# Altium schematic sheet usb_host_slave.SchDoc: Edison Gateway - USB
size Letter; Author: Ye-Sheng Kuo; DocumentNumber: 4; Revision: 3; SheetNumber: 4; SheetTotal: 10
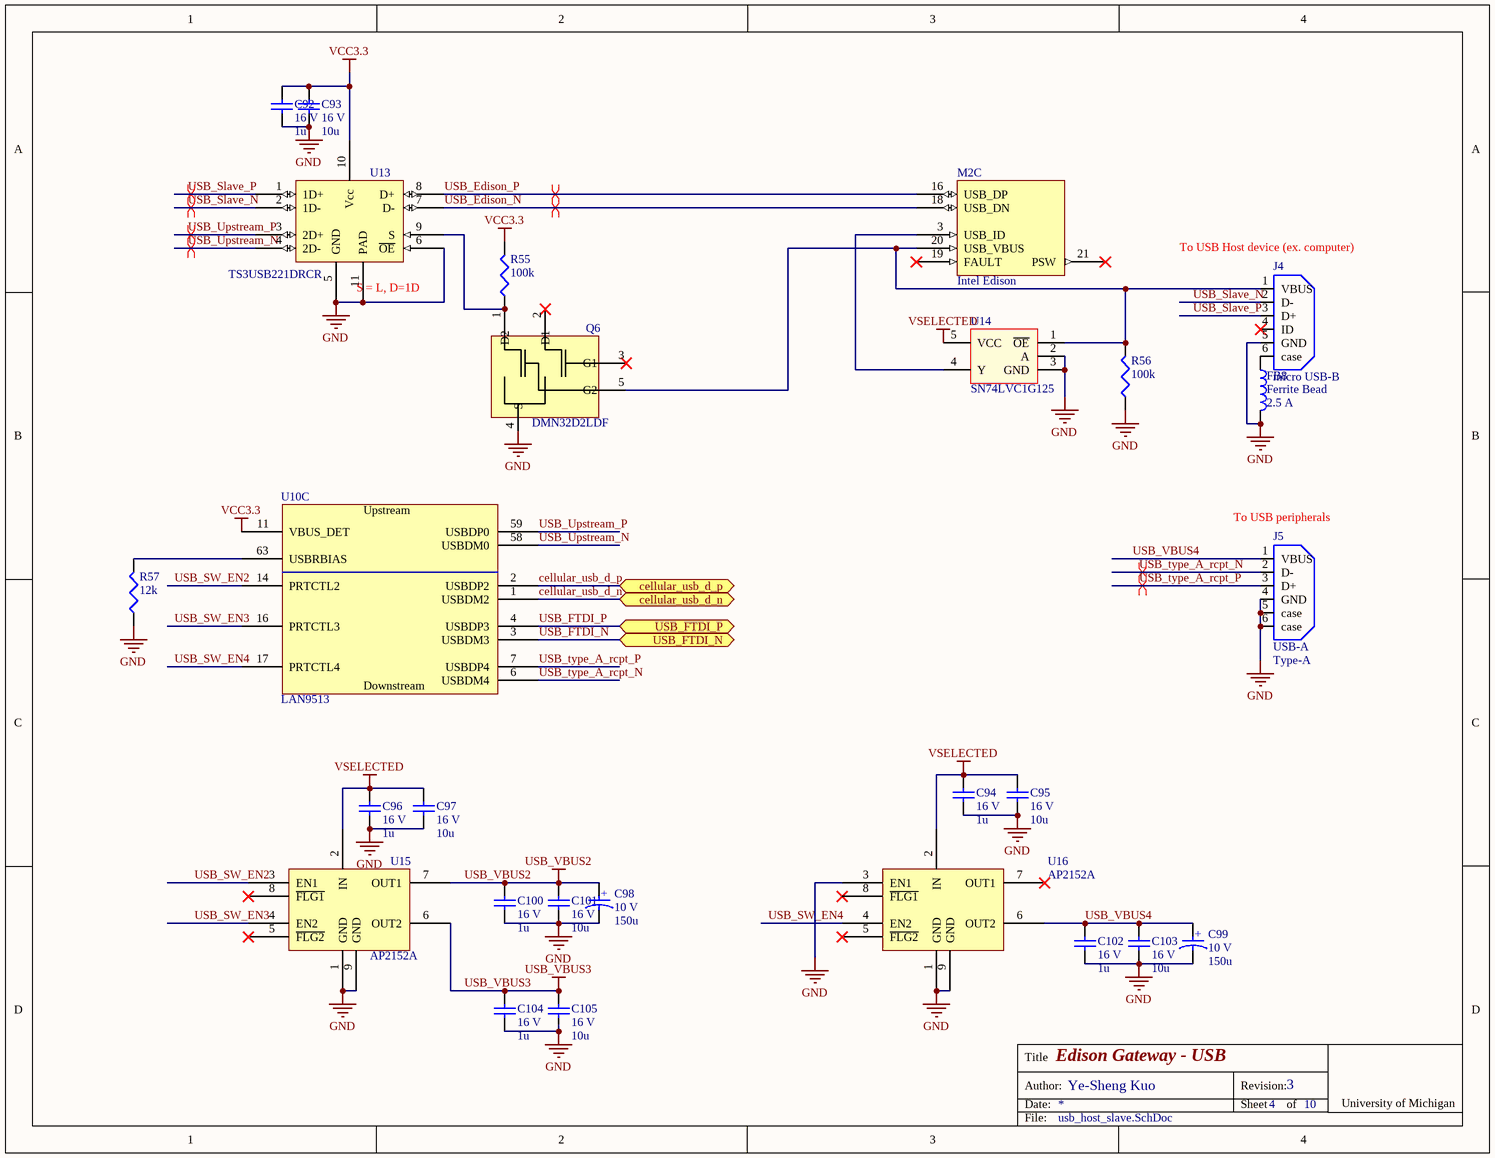
[diagram p0: usb_host_slave.SchDoc]

## Parts
C92  voltage rated: 16 V  [0402]  (hidden comment: 1u)
C93  voltage rated: 16 V  [0603]  (hidden comment: 10u)
C94  voltage rated: 16 V  [0402]  (hidden comment: 1u)
C95  voltage rated: 16 V  [0603]  (hidden comment: 10u)
C96  voltage rated: 16 V  [0402]  (hidden comment: 1u)
C97  voltage rated: 16 V  [0603]  (hidden comment: 10u)
C98  voltage rated: 10 V  [2312]  (hidden comment: 150u)
C99  voltage rated: 10 V  [2312]  (hidden comment: 150u)
C100  voltage rated: 16 V  [0402]  (hidden comment: 1u)
C101  voltage rated: 16 V  [0603]  (hidden comment: 10u)
C102  voltage rated: 16 V  [0402]  (hidden comment: 1u)
C103  voltage rated: 16 V  [0603]  (hidden comment: 10u)
C104  voltage rated: 16 V  [0402]  (hidden comment: 1u)
C105  voltage rated: 16 V  [0603]  (hidden comment: 10u)
FB8  Ferrite Bead  Current Rating (Max): 2.5 A  [0603]
J4  micro USB-B  [Micro USB-B]
J5  USB-A  Type: Type-A  [292303-2]
M2  Intel Edison  [Intel Edison mating]  (part C of 5)
Q6  DMN32D2LDF  [SOT-353-5]
R55  100k  [0402]
R56  100k  [0402]
R57  12k  [0402]
U10  LAN9513  [QFN-64]  (part C of 5)
U13  TS3USB221DRCR  [S-PVSON-N10]
U14  SN74LVC1G125  [SOT23-5]
U15  AP2152A  [U-DFN3030-8]
U16  AP2152A  [U-DFN3030-8]

## Ports
cellular_usb_d_n, cellular_usb_d_p, USB_FTDI_N, USB_FTDI_P

## Nets
GND: C92.2 C93.2 C94.2 C95.2 C96.2 C97.2 C98.2 C99.2 C100.2 C101.2 C102.2 C103.2 C104.2 C105.2 FB8.1 J4.5(GND) J5.4(GND) J5.5(case) J5.6(case) Q6.4(S) R56.2 R57.2 U13.5(GND) U13.6(~{OE}) U13.11(PAD) U14.2(A) U14.3(GND) U15.1(GND) U15.9(GND) U16.1(GND) U16.3(EN1) U16.9(GND)
USB_VBUS2: C98.1 C100.1 C101.1 U15.7(OUT1)
USB_VBUS3: C104.1 C105.1 U15.6(OUT2)
VCC3.3: C92.1 C93.1 R55.1 U10.11(VBUS_DET) U13.10(Vcc)
VSELECTED: C94.1 C95.1 C96.1 C97.1 U14.5(VCC) U15.2(IN) U16.2(IN)
cellular_usb_d_n: U10.1(USBDM2) ; port cellular_usb_d_n
cellular_usb_d_p: U10.2(USBDP2) ; port cellular_usb_d_p
USB_Edison_N: M2.18(USB_DN) U13.7(D-)
USB_Edison_P: M2.16(USB_DP) U13.8(D+)
USB_FTDI_N: U10.3(USBDM3) ; port USB_FTDI_N
USB_FTDI_P: U10.4(USBDP3) ; port USB_FTDI_P
USB_Slave_N: J4.2(D-) U13.2(1D-)
USB_Slave_P: J4.3(D+) U13.1(1D+)
USB_SW_EN2: U10.14(PRTCTL2) U15.3(EN1)
USB_SW_EN3: U10.16(PRTCTL3) U15.4(EN2)
USB_SW_EN4: U10.17(PRTCTL4) U16.4(EN2)
USB_type_A_rcpt_N: J5.2(D-) U10.6(USBDM4)
USB_type_A_rcpt_P: J5.3(D+) U10.7(USBDP4)
USB_Upstream_N: U10.58(USBDM0) U13.4(2D-)
USB_Upstream_P: U10.59(USBDP0) U13.3(2D+)
USB_VBUS4: C99.1 C102.1 C103.1 J5.1(VBUS) U16.6(OUT2)
NetFB8_2: FB8.2 J4.6(case)
NetJ4_1: J4.1(VBUS) M2.20(USB_VBUS) Q6.5(G2) R56.1 U14.1(~{OE})
NetM2_3: M2.3(USB_ID) U14.4(Y)
NetQ6_1: Q6.1(D2) R55.2 U13.9(S)
NetR57_1: R57.1 U10.63(USBRBIAS)

Not connected (* = marked no-connect by the designer): J4 4(ID)*; M2 19(FAULT)* 21(PSW)*; Q6 2(D1)* 3(G1)*; U15 5(~{FLG2})* 8(~{FLG1})*; U16 5(~{FLG2})* 7(OUT1)* 8(~{FLG1})*

## Layout directives
differential pair: USB_Edison_N, USB_Edison_P, USB_Slave_N, USB_Slave_P, USB_type_A_rcpt_N, USB_type_A_rcpt_P, USB_Upstream_N, USB_Upstream_P

## Notes on the sheet
- (near U13) S = L, D=1D
- (near J4) To USB Host device (ex. computer)
- (near J5) To USB peripherals
- Title
- Date:
- Author:
- Revision:
- Sheet
- of
- University of Michigan
- File:
- (in symbol LAN9513, part C) Upstream; Downstream
- (in symbol TAJC157K010RNJ) +

## Library data of the parts
C92 C94 C96 C100 C102 C104 = C1005X6S1C105K050BC: 1µF ±10% 16V Ceramic Capacitor X6S 0402; Manufacture: TDK; tolerance: 10%; package: 0402; Supplier 1: Digi-Key; Supplier Part Number 1: 445-9086-1-ND; Value: 1u; Temperature Coefficient: X6S; Manufacturer Part Number: C1005X6S1C105K050BC
C93 C95 C97 C101 C103 C105 = GRM188C81C106MA73D: 10µF ±20% 16V Ceramic Capacitor X6S 0603; Manufacture: Murata; tolerance: 20%; package: 0603; Temperature Coefficient: X6S; Supplier 1: Digi-Key; Supplier Part Number 1: 490-7198-1-ND; Value: 10u; Manufacturer Part Number: GRM188C81C106MA73D
C98 C99 = TAJC157K010RNJ: 150µF ±10% Molded Tantalum Capacitors 10V 2312; Manufacture: AVX; ESR: 900m Ohm; tolerance: 10%; package: 2312; Supplier 1: Digi-Key; Supplier Part Number 1: 478-2352-1-ND; Value: 150u; Manufacturer Part Number: TAJC157K010RNJ
FB8 = BLM18SG221TN1D: FERRITE BEAD 220 OHM 0603; Manufacturer: Murata; DC resistance: 40m; Impedance @ Frequency: 220 Ohm @ 100MHz; package: 0603; Supplier 1: Digi-Key; Supplier Part Number 1: 490-5225-1-ND; Manufacturer Part Number: BLM18SG221TN1D
J4 = Micro USB: CONN USB MICRO B RECPT SMT R/A; Supplier 1: Digi-Key; Supplier Part Number 1: 609-4616-1-ND
J5 = A105221-ND: USB 2.0 Type A; Supplier 1: Digi-Key; Supplier Part Number 1: A105221-ND
M2 = Intel Edison: Note: Mating connector: H124603CT-ND
Q6 = DMN32D2LDF: Common Source Dual N-Channel MOSFET; Supplier 1: Digi-Key; Supplier Part Number 1: DMN32D2LDF-7DICT-ND
R55 R56 = CRCW0402100KFKED: RES SMD 100K OHM 1% 1/16W 0402; Manufacturer: Vishay Dale; Temperature Coefficient: 100 ppm/C; Tolerance: 1%; Power: 1/16 W; Supplier 1: Digi-Key; Supplier Part Number 1: 541-100KLCT-ND; package: 0402; value: 100k; Manufacturer Part Number: CRCW0402100KFKED
R57 = CRCW040212K0FKED: RES SMD 12K OHM 1% 1/16W 0402; Manufacturer: Vishay Dale; Temperature Coefficient: 100 ppm/C; Tolerance: 1%; Power: 1/16 W; package: 0402; Supplier 1: Digi-Key; Supplier Part Number 1: 541-12.0KLCT-ND; value: 12k; Manufacturer Part Number: CRCW040212K0FKED
U10 = LAN9513: USB 2.0 Hub and 10/100  Ethernet Controller; Supplier 1: Digi-Key; Supplier Part Number 1: LAN9513-JZX-ND
U13 = TS3USB221DRCR: High-Speed USB 2.0 (480-Mbps) 1:2 Multiplexer – Demultiplexer  Switch With Single Enable; Supplier 1: Digi-Key; Supplier Part Number 1: 296-21360-6-ND
U14 = SN74LVC1G125: Single Bus Buffer Gate With 3-State Output; Supplier 1: Digi-Key; Supplier Part Number 1: 296-11603-1-ND
U15 U16 = AP2152A: 0.5A DUAL CHANNEL CURRENT-LIMITED  POWER SWITCH WITH OUTPUT DISCHARGE; Supplier 1: Digi-Key; Supplier Part Number 1: AP2152AFGEG-7DICT-ND